# Altium schematic sheet Schematic.SchDoc
size A; SheetNumber: 1; SheetTotal: 1
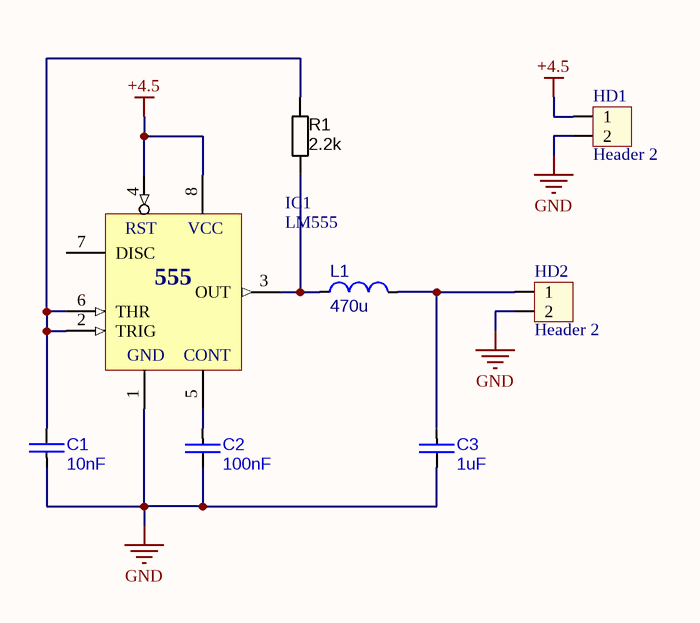
[diagram p0: Schematic.SchDoc]

## Parts
C1  value 10nF  [CAPC2012X135N]  (hidden comment: approved sub OK)
C2  value 100nF  [CAPC2012X135N]  (hidden comment: approved sub OK)
C3  value 1uF  [CAPC2012X135N]  (hidden comment: approved sub OK)
HD1  Header 2  [HED2]
HD2  Header 2  [HED2]
IC1  LM555  [DIP8/W0.3]
L1  470u  [INDM2520X190N]
R1  value 2.2k  [RESC2012N_ZERO]  (hidden comment: Jumper)

## Nets
+4.5: HD1.1 IC1.4(RST) IC1.8(VCC)
GND: C1.1 C2.2 C3.2 HD1.2 HD2.2 IC1.1(GND)
NetC1_2: C1.2 IC1.2(TRIG) IC1.6(THR) R1.1
NetC2_1: C2.1 IC1.5(CONT)
NetC3_1: C3.1 HD2.1 L1.2
NetIC1_3: IC1.3(OUT) L1.1 R1.2

Not connected (* = marked no-connect by the designer): IC1 7(DISC)

## Notes on the sheet
- (in symbol LM555) 555

## Library data of the parts
C1-C3 = CAP C_0805: Capacitor SMD Cer 1.8nF 10% 50V X7R 0805; Manufacturer 1: AVX Corporation; Manufacturer Part Number 1: 08055C182KAT2A; Ratings: 50V; X7R; SCDType: source*; Tolerance: ±10%; Operating Temperature: -55°C ~ 125°C; Package / Case: 0805 (2012 metric); Supplier 1: Digi-Key; Supplier Part Number 1: 478-1374-1-ND
HD1 HD2 = Header 2: Header 2 (Green); Value: Header 2
IC1 = LM555: Timer; Value: LM555
L1 = Inductor_1008: Inductor SMD chip 47nH 1008; Manufacturer 1: Abracon Corporation; Manufacturer Part Number 1: AISC-1008-R047J-T; Ratings: 1 A; Tolerance: ±5%; Material: Ceramic; DC Resistance (DCR): 160 mOhm Max; SCDType: source; Package / Case: 1008 (2520 Metric); Supplier 1: Digi-Key; Supplier Part Number 1: 535-10535-1-ND; Value: 470u
R1 = RES_0805: Resistor SMD chip 0.0 Ohm 0.125W 0805; Manufacturer 1: Samsung Electro-Mechanics America, Inc; Manufacturer Part Number 1: RC2012J000CS; Ratings: 1/8W; SCDType: spec; Tolerance: N/A; Package / Case: 0805 (2012 metric); Supplier 1: Digi-Key; Supplier Part Number 1: 1276-5466-6-ND; RoHS 1: RoHS Compliant; ComponentLink1URL: http://www.samsungsem.com/servlet/FileDownload?filename=productcatalog/pdf/Chip_Resistor.pdf; ComponentLink1Description: http://www.samsungsem.com/servlet/FileDownload?filename=productcatalog/pdf/Chip_Resistor.pdf; Supplier 2: Digi-Key; Supplier Part Number 2: RMCF0805ZT0R00DKR-ND; Manufacturer 2: Stackpole Electronics Inc; Manufacturer Part Number 2: RMCF0805ZT0R00; RoHS 2: RoHS Compliant; ComponentLink2URL: http://www.seielect.com/Catalog/SEI-RMCF_RMCP.pdf; ComponentLink2Description: http://www.seielect.com/Catalog/SEI-RMCF_RMCP.pdf; Supplier 3: Digi-Key; Supplier Part Number 3: 311-0.0ARDKR-ND; Manufacturer 3: Yageo; Manufacturer Part Number 3: RC0805JR-070RL; RoHS 3: RoHS Compliant; ComponentLink3URL: http://media.digikey.com/pdf/Data%20Sheets/Yageo%20PDFs/RC0805%20Pb%20Free.pdf; ComponentLink3Description: http://media.digikey.com/pdf/Data%20Sheets/Yageo%20PDFs/RC0805%20Pb%20Free.pdf; Supplier 4: Digi-Key; Supplier Part Number 4: P0.0ADKR-ND; Manufacturer 4: Panasonic Electronic Components; Manufacturer Part Number 4: ERJ-6GEY0R00V; RoHS 4: RoHS Compliant; ComponentLink4URL: http://industrial.panasonic.com/www-cgi/jvcr13pz.cgi?E+PZ+3+AOA0001+ERJ6GEY0R00V+7+WW; ComponentLink4Description: http://industrial.panasonic.com/www-cgi/jvcr13pz.cgi?E+PZ+3+AOA0001+ERJ6GEY0R00V+7+WW; Supplier 5: Digi-Key; Supplier Part Number 5: RHM0.0CPDKR-ND; Manufacturer 5: Rohm Semiconductor; Manufacturer Part Number 5: MCR10ERTJ000; RoHS 5: RoHS Compliant; ComponentLink5URL: http://rohmfs.rohm.com/en/products/databook/datasheet/passive/resistor/chip_resistor/mcr_g.pdf; ComponentLink5Description: http://rohmfs.rohm.com/en/products/databook/datasheet/passive/resistor/chip_resistor/mcr_g.pdf